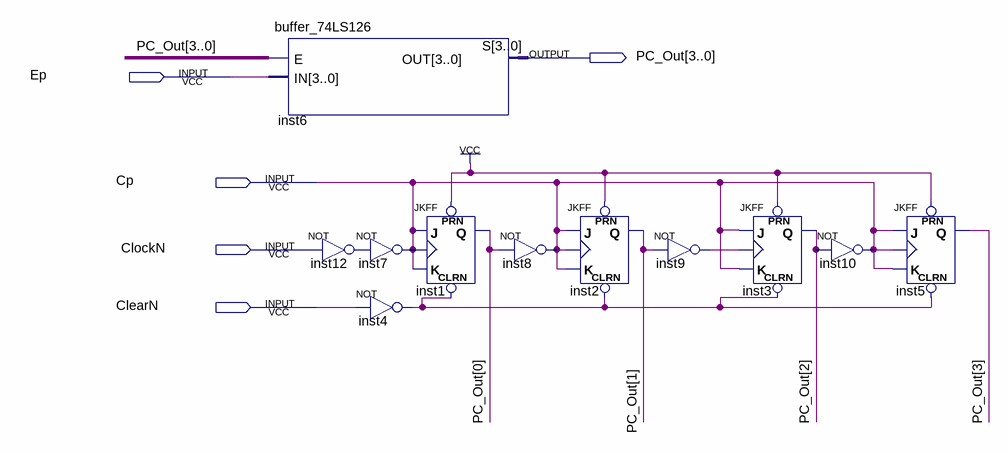
[diagram p0: schematic sheet]
// Quartus schematic counter_program.bdf as structural Verilog: 11 symbols, 5 pins
module counter_program (
  input  Ep,
  input  Cp,
  input  ClockN,
  input  ClearN,
  output [3:0] PC_Out
);

  wire inst4_out, inst9_out, inst12_out;

  buffer_74LS126 inst6 (.E(PC_Out), .IN({4{Ep}}), .OUT(PC_Out));
  not inst12 (inst12_out, ClockN);
  JKFF inst1 (.PRN(1'b1), .CLRN(inst4_out), .K(Cp), .J(Cp), .CLK(Cp), .Q(PC_Out[0]));
  not inst7 (Cp, inst12_out);
  not inst4 (inst4_out, ClearN);
  not inst8 (Cp, PC_Out[0]);
  JKFF inst2 (.PRN(1'b1), .CLRN(inst4_out), .K(Cp), .J(Cp), .CLK(Cp), .Q(PC_Out[1]));
  not inst9 (inst9_out, PC_Out[1]);
  JKFF inst3 (.PRN(1'b1), .CLRN(inst4_out), .K(Cp), .J(Cp), .CLK(inst9_out), .Q(PC_Out[2]));
  not inst10 (Cp, PC_Out[2]);
  JKFF inst5 (.PRN(1'b1), .CLRN(inst4_out), .K(Cp), .J(Cp), .CLK(Cp), .Q(PC_Out[3]));

  // Other names for the same wires on the sheet: S[3:0] = PC_Out
endmodule
